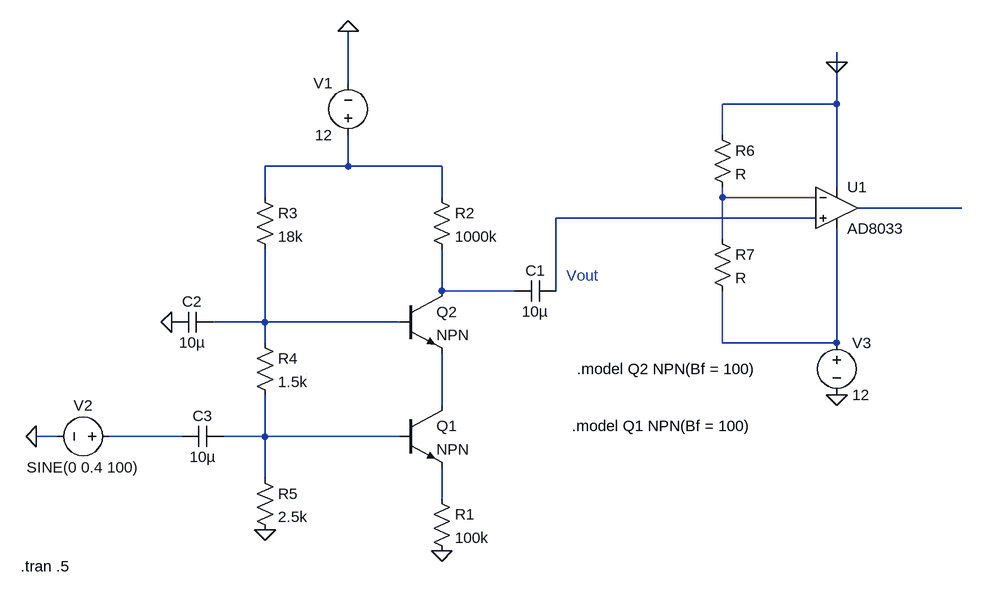
[diagram p0: schematic cascade_amp.asc]
cascade_amp.asc, the LTspice schematic file:
Version 4
SHEET 1 1108 680
WIRE 912 -384 912 -400
WIRE 160 -352 160 -432
WIRE 912 -320 912 -384
WIRE 912 -320 736 -320
WIRE 736 -272 736 -320
WIRE 160 -224 160 -272
WIRE 160 -224 32 -224
WIRE 304 -224 160 -224
WIRE 912 -192 912 -320
WIRE 32 -176 32 -224
WIRE 304 -176 304 -224
WIRE 736 -176 736 -192
WIRE 880 -176 736 -176
WIRE 1104 -160 944 -160
WIRE 880 -144 480 -144
WIRE 736 -112 736 -176
WIRE 304 -32 304 -96
WIRE 416 -32 304 -32
WIRE 480 -32 480 -144
WIRE 32 16 32 -96
WIRE 32 16 -48 16
WIRE 240 16 32 16
WIRE 32 48 32 16
WIRE 736 48 736 -32
WIRE 912 48 912 -128
WIRE 912 48 736 48
WIRE 304 144 304 64
WIRE -288 192 -320 192
WIRE -96 192 -208 192
WIRE 32 192 32 128
WIRE 32 192 -32 192
WIRE 240 192 32 192
WIRE 32 256 32 192
WIRE 304 288 304 240
FLAG 304 368 0
FLAG 160 -432 0
FLAG -112 16 0
FLAG -320 192 0
FLAG 32 336 0
FLAG 912 -384 0
FLAG 912 128 0
SYMBOL npn 240 144 R0
SYMATTR InstName Q1
SYMBOL npn 240 -32 R0
SYMATTR InstName Q2
SYMBOL res 288 272 R0
SYMATTR InstName R1
SYMATTR Value 100k
SYMBOL cap 480 -48 R90
WINDOW 0 0 32 VBottom 2
WINDOW 3 32 32 VTop 2
SYMATTR InstName C1
SYMATTR Value 10µ
SYMBOL res 288 -192 R0
SYMATTR InstName R2
SYMATTR Value 1000k
SYMBOL res 16 -192 R0
SYMATTR InstName R3
SYMATTR Value 18k
SYMBOL voltage 160 -256 R180
WINDOW 0 24 96 Left 2
WINDOW 3 24 16 Left 2
WINDOW 123 0 0 Left 0
WINDOW 39 0 0 Left 0
SYMATTR InstName V1
SYMATTR Value 12
SYMBOL cap -48 0 R90
WINDOW 0 0 32 VBottom 2
WINDOW 3 32 32 VTop 2
SYMATTR InstName C2
SYMATTR Value 10µ
SYMBOL res 16 32 R0
SYMATTR InstName R4
SYMATTR Value 1.5k
SYMBOL cap -32 176 R90
WINDOW 0 0 32 VBottom 2
WINDOW 3 32 32 VTop 2
SYMATTR InstName C3
SYMATTR Value 10µ
SYMBOL voltage -192 192 R90
WINDOW 0 -32 56 VBottom 2
WINDOW 3 32 56 VTop 2
WINDOW 123 0 0 Left 0
WINDOW 39 0 0 Left 0
SYMATTR InstName V2
SYMATTR Value SINE(0 0.4 100)
SYMBOL res 16 240 R0
SYMATTR InstName R5
SYMATTR Value 2.5k
SYMBOL OpAmps\\AD8033 912 -224 R0
SYMATTR InstName U1
SYMBOL res 720 -288 R0
SYMATTR InstName R6
SYMBOL res 720 -128 R0
SYMATTR InstName R7
SYMBOL voltage 912 32 R0
SYMATTR InstName V3
SYMATTR Value 12
TEXT 496 -56 Left 2 ;Vout
TEXT 512 88 Left 2 !.model Q2 NPN(Bf = 100)
TEXT 504 176 Left 2 !.model Q1 NPN(Bf = 100)
TEXT -344 392 Left 2 !.tran .5
LINE Normal 96 96 96 96 2

The netlist it stands for:
* cascade_amp.asc
Q1 N008 N010 N011 0 NPN
Q2 N005 N006 N008 0 NPN
R1 N011 0 100k
C1 N004 N005 10µ
R2 N001 N005 1000k
R3 N001 N006 18k
V1 N001 0 12
C2 N006 0 10µ
R4 N006 N010 1.5k
C3 N010 N009 10µ
V2 N009 0 SINE(0 0.4 100)
R5 N010 0 2.5k
XU1 N004 N002 0 N007 N003 AD8033  ; pins In+ In- V+ V- OUT
R6 0 N002 R
R7 N002 N007 R
V3 N007 0 12
.model NPN NPN
.model PNP PNP
.lib standard.bjt
* Vout
.model Q2 NPN(Bf = 100)
.model Q1 NPN(Bf = 100)
.tran .5
.backanno
.end